# EAGLE design KL02LogicThingie (EAGLE 6.5.0)
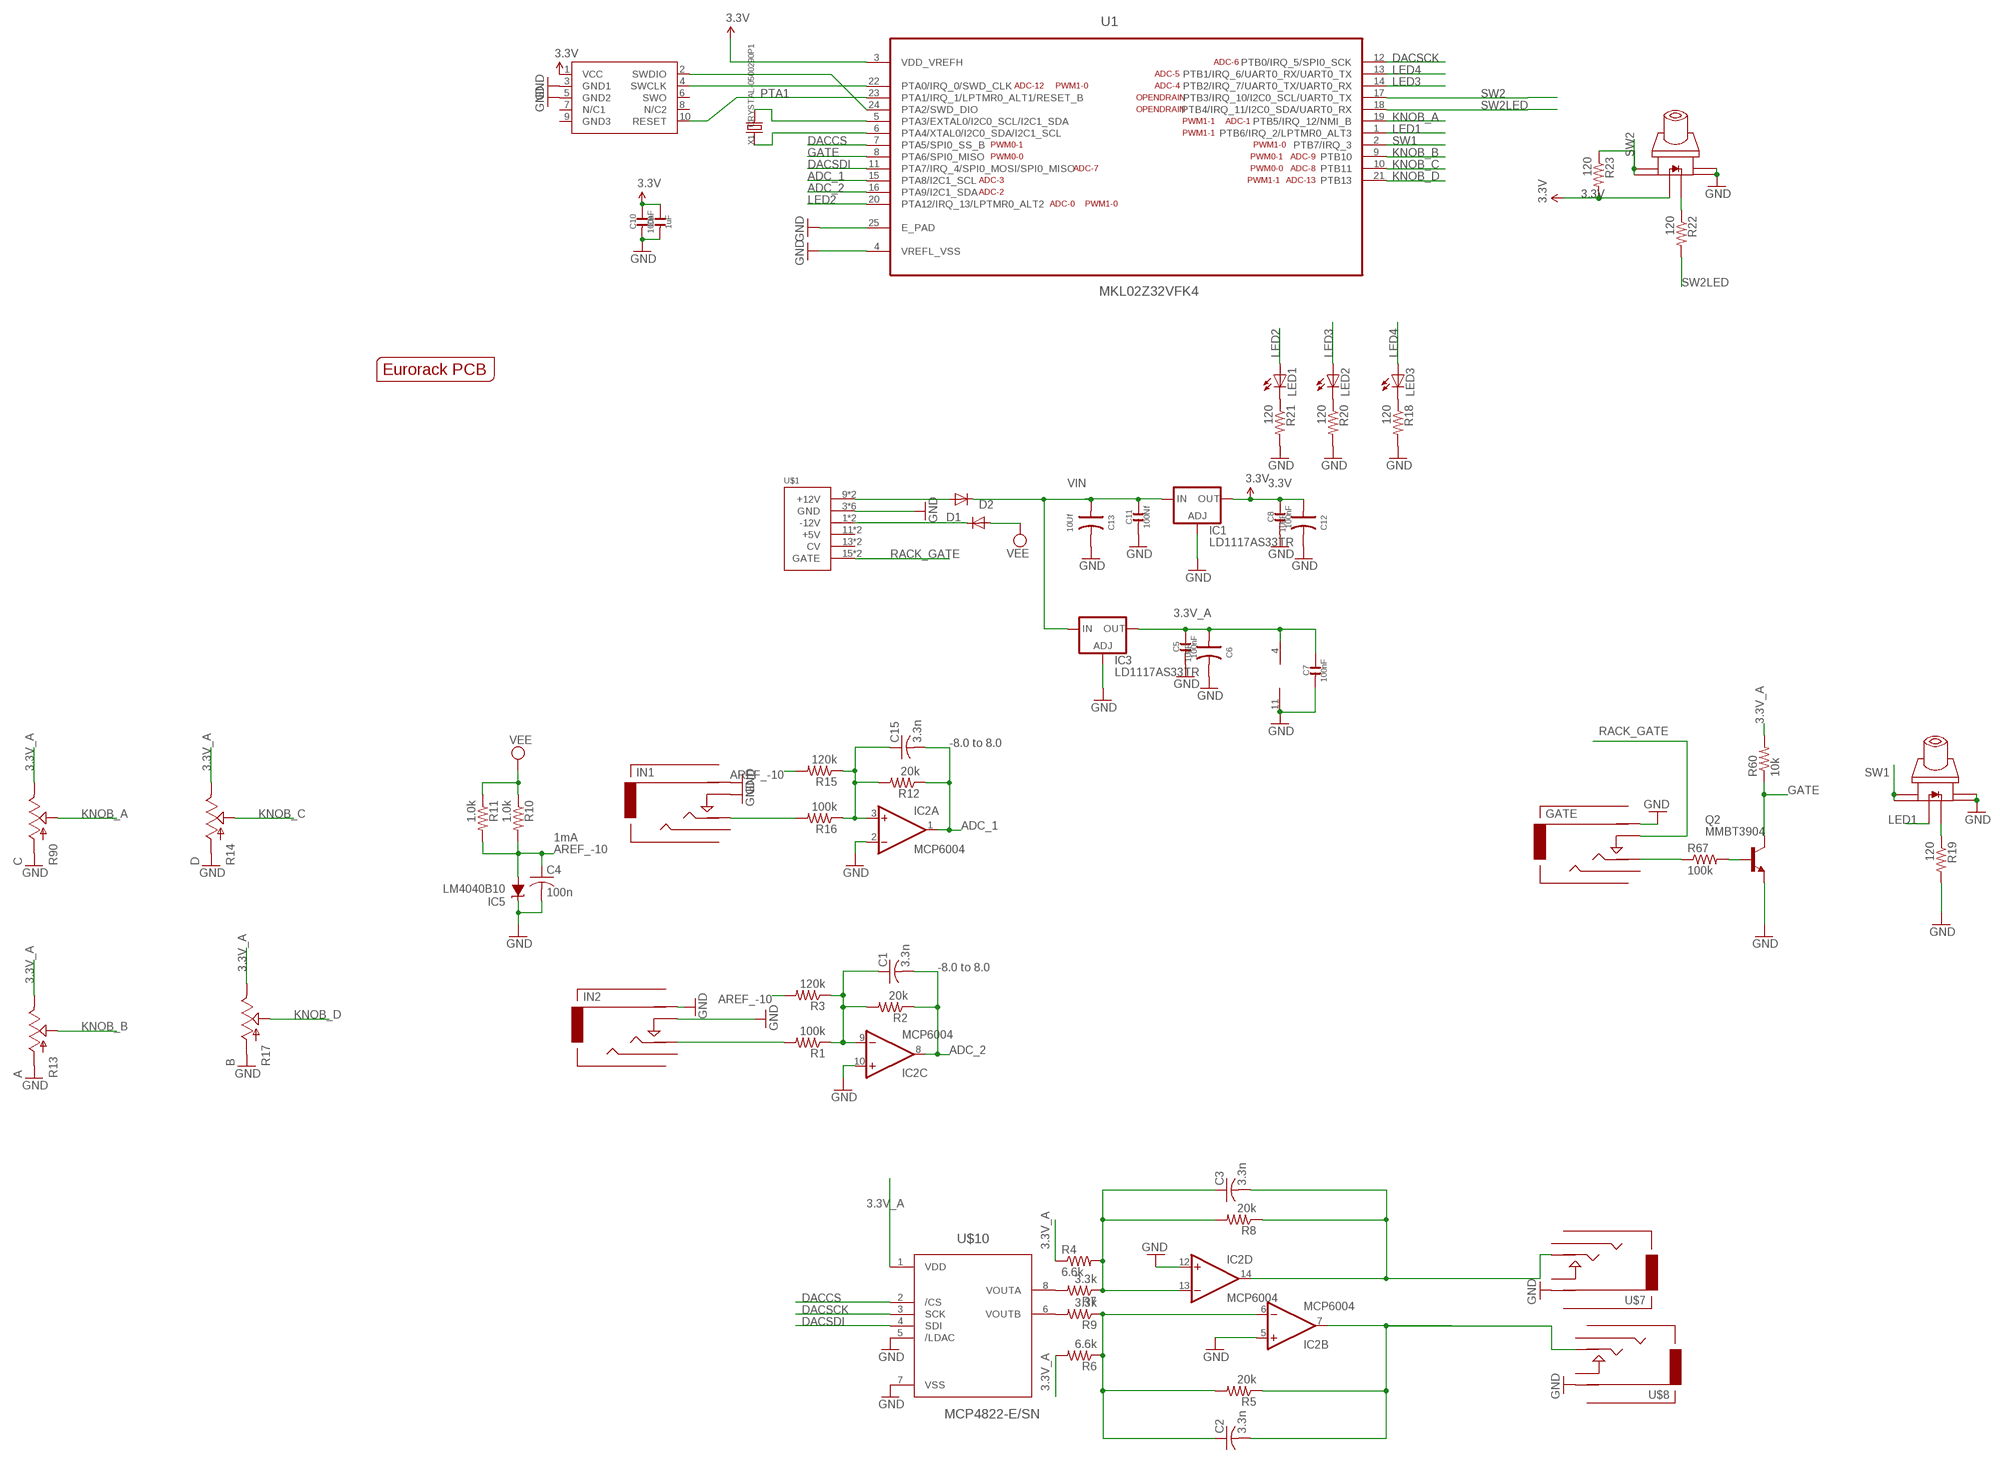
[diagram p0: schematic, sheet 1]

## Parts
C1  3.3n  C-USC0603  [C0603]
C2  3.3n  C-USC0603  [C0603]
C3  3.3n  C-USC0603  [C0603]
C4  100n  C-USC0603  [C0603]
C5  100nF  C-0603  [C0603]
C6  10uF  C-POLAR-A  [AVX-A]
C7  100nF  C-0603  [C0603]
C8  100nF  C-0603  [C0603]
C9  1uF  C-0603  [C0603]
C10  100nF  C-0603  [C0603]
C11  100Nf  C-0603  [C0603]
C12  10uF  C-POLAR-A  [AVX-A]
C13  10Uf  C-POLAR-A  [AVX-A]
C15  3.3n  C-USC0603  [C0603]
D1  1N5819HW  DIODE-SOD123  [SOD123]
D2  1N5819HW  DIODE-SOD123  [SOD123]
GATE  Gate  AUDIO-JACKINPUT  [3.5MM-JACK-SWITCH-13MM-INPUT]
IC1  LD1117AS33TR  [SOT223]
IC2  MCP6004  TL074D  [SO14]
IC3  LD1117AS33TR  [SOT223]
IC5  LM4040B10  LM4041B12DBZ  [DBZ_R-PDSO-G3]
IN1  In 2  AUDIO-JACKINPUT  [3.5MM-JACK-SWITCH-13MM-INPUT]
IN2  In 1  AUDIO-JACKINPUT  [3.5MM-JACK-SWITCH-13MM-INPUT]
LED1  LED3MM  [LED3MM]
LED2  LED3MM  [LED3MM]
LED3  LED3MM  [LED3MM]
Q2  MMBT3904  MMBT3904LT1-NPN-SOT23-BEC  [SOT23-BEC]
R1  100k  R-US_R0603  [R0603]
R2  20k  R-US_R0603  [R0603]
R3  120k  R-US_R0603  [R0603]
R4  6.6k  R-US_R0603  [R0603]
R5  20k  R-US_R0603  [R0603]
R6  6.6k  R-US_R0603  [R0603]
R7  3.3k  R-US_R0603  [R0603]
R8  20k  R-US_R0603  [R0603]
R9  3.3k  R-US_R0603  [R0603]
R10  1.0k  R-US_R0603  [R0603]
R11  1.0k  R-US_R0603  [R0603]
R12  20k  R-US_R0603  [R0603]
R13  A  POTZEPHPOT  [OG-POTS_ALPS_POT_VERTICAL]
R14  D  POTZEPHPOT  [OG-POTS_ALPS_POT_VERTICAL]
R15  120k  R-US_R0603  [R0603]
R16  100k  R-US_R0603  [R0603]
R17  B  POTZEPHPOT  [OG-POTS_ALPS_POT_VERTICAL]
R18  120  R-US_R0603  [R0603]
R19  120  R-US_R0603  [R0603]
R20  120  R-US_R0603  [R0603]
R21  120  R-US_R0603  [R0603]
R22  120  R-US_R0603  [R0603]
R23  120  R-US_R0603  [R0603]
R60  10k  R-US_R0603  [R0603]
R67  100k  R-US_R0603  [R0603]
R90  C  POTZEPHPOT  [OG-POTS_ALPS_POT_VERTICAL]
SWD1  CORTEX_SWD  [M50-3600542]
U1  MKL02Z32VFK4  [QFN50P400X400X100-25N]
U$1  POWER  [POWER_16]
U$2  EURORACK_PCB8HP  [EURORACK8HPPCB]
U$3  SWITCH_W_LED_PB6149L-X-102WHITE  [PB6149L]
U$6  SWITCH_W_LED_PB6149L-X-102WHITE  [PB6149L]
U$7  Out 2  AUDIO-JACKOUTPUT  [3.5MM-JACK-SWITCH-13MM-OUTPUT]
U$8  Out 1  AUDIO-JACKOUTPUT  [3.5MM-JACK-SWITCH-13MM-OUTPUT]
U$10  MCP4822-E/SN  [SOIC8-N_MC]
X1  CRYSTAL-0500290P1  [2P-SMD-5.0X3.2]

## Nets
3.3V: C8.2 C9.2 C10.2 C12.+ IC1.2(OUT) IC1.4(OUT) R23.2 SWD1.1(VCC) U1.3(VDD_VREFH) U$3.LEDPOS(POS)
3.3V_A: C5.2 C6.+ C7.2 IC2.4(P:V+) IC3.2(OUT) IC3.4(OUT) R4.1 R6.2 R13.P$1(E) R14.P$1(E) R17.P$1(E) R60.2 R90.P$1(E) U$10.1(VDD)
ADC_1: C15.2 IC2.1(A:OUT) R12.1 U1.15(PTA8/I2C1_SCL)
ADC_2: C1.2 IC2.8(C:OUT) R2.1 U1.16(PTA9/I2C1_SDA)
AREF_-10: C4.1 IC5.2(A) R3.2 R10.2 R11.2 R15.2
DACCS: U1.7(PTA5/SPI0_SS_B) U$10.2(/CS)
DACSCK: U1.12(PTB0/IRQ_5/SPI0_SCK) U$10.3(SCK)
DACSDI: U1.11(PTA7/IRQ_4/SPI0_MOSI/SPI0_MISO) U$10.4(SDI)
GATE: Q2.C R60.1 U1.8(PTA6/SPI0_MISO)
GND: C4.2 C5.1 C6.- C7.1 C8.1 C9.1 C10.1 C11.1 C12.- C13.- GATE.RING@1(RING) GATE.RING@2(RING) IC1.1(ADJ) IC2.2(A:-IN) IC2.5(B:+IN) IC2.10(C:+IN) IC2.11(P:V-) IC2.12(D:+IN) IC3.1(ADJ) IC5.1(C) IN1.RING@1(RING) IN1.RING@2(RING) IN1.SWITCH@1(SWITCH) IN1.SWITCH@2(SWITCH) IN2.RING@1(RING) IN2.RING@2(RING) IN2.SWITCH@1(SWITCH) IN2.SWITCH@2(SWITCH) Q2.E R13.P$3(A) R14.P$3(A) R17.P$3(A) R18.2 R19.2 R20.2 R21.2 R90.P$3(A) SWD1.3(GND1) SWD1.5(GND2) U1.4(VREFL_VSS) U1.25(E_PAD) U$1.3(GND) U$1.4(GND) U$1.5(GND) U$1.6(GND) U$1.7(GND) U$1.8(GND) U$3.3 U$3.4 U$6.3 U$6.4 U$7.RING@1(RING) U$7.RING@2(RING) U$8.RING@1(RING) U$8.RING@2(RING) U$10.5(/LDAC) U$10.7(VSS)
KNOB_A: R90.P$2(S) U1.19(PTB5/IRQ_12/NMI_B)
KNOB_B: R13.P$2(S) U1.9(PTB10)
KNOB_C: R14.P$2(S) U1.10(PTB11)
KNOB_D: R17.P$2(S) U1.21(PTB13)
LED1: U1.1(PTB6/IRQ_2/LPTMR0_ALT3) U$6.LEDPOS(POS)
LED2: LED1.A U1.20(PTA12/IRQ_13/LPTMR0_ALT2)
LED3: LED2.A U1.14(PTB2/IRQ_7/UART0_TX/UART0_RX)
LED4: LED3.A U1.13(PTB1/IRQ_6/UART0_RX/UART0_TX)
N$1: U1.5(PTA3/EXTAL0/I2C0_SCL/I2C1_SDA) X1.2
N$2: U1.6(PTA4/XTAL0/I2C0_SDA/I2C1_SCL) X1.1
N$3: IN1.TIP@1(TIP) IN1.TIP@2(TIP) R16.2
N$4: C15.1 IC2.3(A:+IN) R12.2 R15.1 R16.1
N$5: SWD1.4(SWCLK) U1.22(PTA0/IRQ_0/SWD_CLK)
N$6: IN2.TIP@1(TIP) IN2.TIP@2(TIP) R1.2
N$7: SWD1.2(SWDIO) U1.24(PTA2/SWD_DIO)
N$8: C1.1 IC2.9(C:-IN) R1.1 R2.2 R3.1
N$9: C2.1 IC2.6(B:-IN) R5.2 R6.1 R9.1
N$10: C3.1 IC2.13(D:-IN) R4.2 R7.1 R8.2
N$11: R7.2 U$10.8(VOUTA)
N$12: R9.2 U$10.6(VOUTB)
N$13: D1.A U$1.9(+12V) U$1.10(+12V)
N$14: R19.1 U$6.LEDNEG(NEG)
N$15: LED3.K(C) R18.1
N$16: LED2.K(C) R20.1
N$17: LED1.K(C) R21.1
N$18: C3.2 IC2.14(D:OUT) R8.1 U$7.TIP@1(TIP) U$7.TIP@2(TIP)
N$19: R22.1 U$3.LEDNEG(NEG)
N$24: C2.2 IC2.7(B:OUT) R5.1 U$8.TIP@1(TIP) U$8.TIP@2(TIP)
N$43: GATE.TIP@1(TIP) GATE.TIP@2(TIP) R67.1
N$64: D2.C U$1.1(-12V) U$1.2(-12V)
N$66: Q2.B R67.2
PTA1: SWD1.10(RESET) U1.23(PTA1/IRQ_1/LPTMR0_ALT1/RESET_B)
RACK_GATE: GATE.SWITCH@1(SWITCH) GATE.SWITCH@2(SWITCH) U$1.15(GATE) U$1.16(GATE)
SW1: U1.2(PTB7/IRQ_3) U$6.1 U$6.2
SW2: R23.1 U1.17(PTB3/IRQ_10/I2C0_SCL/UART0_TX) U$3.1 U$3.2
SW2LED: R22.2 U1.18(PTB4/IRQ_11/I2C0_SDA/UART0_RX)
VEE: D2.A R10.1 R11.1
VIN: C11.2 C13.+ D1.C IC1.3(IN) IC3.3(IN)
Unconnected: GATE.SECOND@1(SECOND) GATE.SECOND@2(SECOND) IN1.SECOND@1(SECOND) IN1.SECOND@2(SECOND) IN2.SECOND@1(SECOND) IN2.SECOND@2(SECOND) SWD1.6(SWO) SWD1.7(N/C1) SWD1.8(N/C2) SWD1.9(GND3) U$1.11(+5V) U$1.12(+5V) U$1.13(CV) U$1.14(CV) U$7.SECOND@1(SECOND) U$7.SECOND@2(SECOND) U$7.SWITCH@1(SWITCH) U$7.SWITCH@2(SWITCH) U$8.SECOND@1(SECOND) U$8.SECOND@2(SECOND) U$8.SWITCH@1(SWITCH) U$8.SWITCH@2(SWITCH)

## Notes on the sheet
- -8.0 to 8.0
- 1mA
- -8.0 to 8.0

## Library data of the parts
C1-C4 C15 = rcl:C-US: CAPACITOR, American symbol
C5 C7-C11 = OPL:C*
C6 C12 C13 = OPL:C-POLAR*
D1 D2 = diode:DIODE-: DIODE
GATE IN1 IN2 U$7 U$8 = EurorackModularParts:AUDIO-JACK: Switching Mono 3.5mm Audio Jack from Erthenvar.
IC1 IC3 = ld-components:LD1117A?*: Low drop fixed and adjustable positive voltage regulators 1 A Source: http://www.st.com/stonline/products/literature/ds/7194/ld1117axx.pdf
IC2 = gm-ics:TL074: OP AMP
IC5 = texas:LM4041: PRECISION MICROPOWER SHUNT VOLTAGE REFERENCE Source: http://focus.ti.com/lit/ds/slcs146e/slcs146e.pdf; MPN: LM4041B12IDBZR; OC_FARNELL: 1575212; OC_NEWARK: 58K5882
LED1-LED3 = SparkFun-LED:LED: LEDs Standard schematic elements and footprints for 5mm, 3mm, 1206, and 0603 sized LEDs. 5mm - Spark Fun Electronics SKU : COM-00529 (and others)
Q2 = transistor:*-NPN-: NPN Transistror BF959 corrected 2008.03.06
R1-R12 R15 R16 R18-R23 R60 R67 = rcl:R-US_: RESISTOR, American symbol
R13 R14 R17 R90 = EurorackModularParts:POT
SWD1 = carrilib with jtags:CORTEX_SWD: .05" Cortex M Connector in SWD mode Manufacturer: Generic Part Number: Cortex M SWD Notes: I use Harwin M50-3600542 connectors
U1 = FarnellThings:MKL02Z32VFK4: IC, MCU, 32BIT, CORTEX M0+, 48MHZ, QFN-24; MPN: MKL02Z32VFK4; OC_FARNELL: 2321481; OC_NEWARK: 61W9887; PACKAGE: QFN-24; SUPPLIER: FREESCALE SEMICONDUCTOR
U$1 = eurorack:POWER
U$2 = EurorackModularParts:EURORACK_PCB
U$3 U$6 = zephod-components:SWITCH_W_LED_PB6149L-X-102
U$10 = FarnellThings:MCP4822-E/SN: 12 Bit DAC; DESCRIPTION: 12 Bit DAC; MPN: MCP4822-E/SN; OC_FARNELL: 1439414; OC_NEWARK: 31K2975; PACKAGE: SOIC-8; SUPPLIER: Microchip
X1 = OPL:CRYSTAL*

## Board
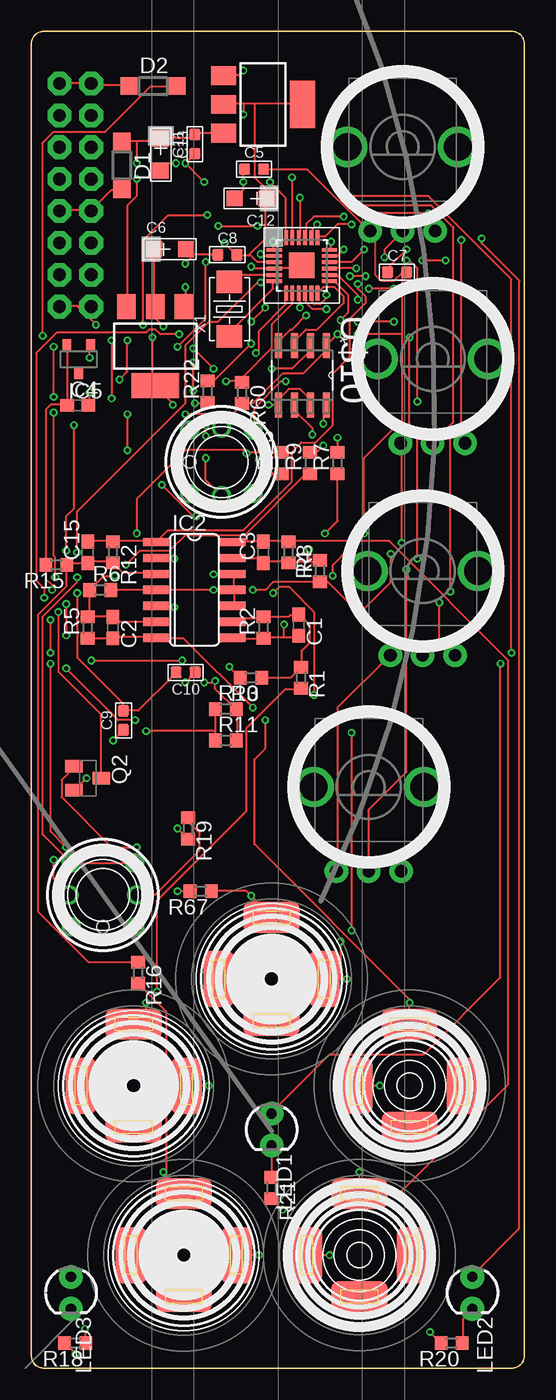
[diagram p1: board, top side]
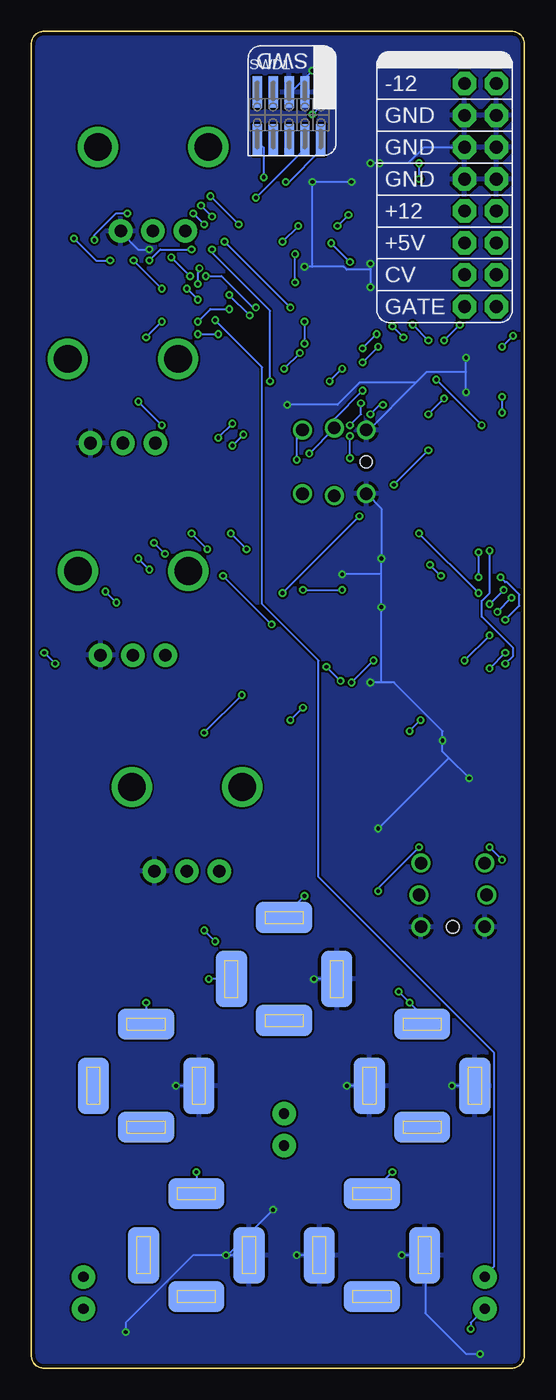
[diagram p2: board, bottom side, seen from below]

Size 39.3 x 106.5 mm. Coordinates in mm from the lower left corner, seen from the top.
Copper layers (1*16): Top 0.035mm / dielectric 1.5mm / Bottom 0.035mm
Design rules "ITEADstudio_DRC": minimum track width 6mil, minimum drill 12mil, track to track 6mil, track to pad 6mil, pad to pad 6mil, via to via 6mil, smd to smd 0mil, copper to edge 10mil, drill to drill 10mil, minimum pad ring 10mil, minimum via ring 6mil, stop-mask expansion 2mil, vias tented up to drill 100mil, thermal gap 10mil

### Footprints (pad centres in the part's own frame; a part is rotated, then mirrored left to right if it is on the bottom)
C0603 = smd 1.1 x 1: 1 -0.85,0; 2 0.85,0
C0603' = smd 0.889 x 0.889: 1 -0.762,0; 2 0.762,0
AVX-A = smd 1.27 x 1.27: + -1.27,0; - 1.27,0
SOD123 = smd 1.4 x 1.4: A 1.9,0; C -1.9,0
3.5MM-JACK-SWITCH-13MM-INPUT = smd 2.5 x 4.5: RING@1 -4.2,0; SWITCH@1 4.2,0 | smd 2.5 x 4.5 bottom: RING@2 -4.2,0; SWITCH@2 4.2,0 | smd 4.5 x 2.5: SECOND@1 0,-3.3; TIP@1 0,4.9 | smd 4.5 x 2.5 bottom: SECOND@2 0,-3.3; TIP@2 0,4.9
SOT223 = smd 1.5 x 2: 1 -2.3,-3.15; 2 0,-3.15; 3 2.3,-3.15 | smd 3.8 x 2: 4 0,3.15
SO14 = smd 0.66 x 2.032: 1 -3.81,-3.073; 2 -2.54,-3.073; 3 -1.27,-3.073; 4 0,-3.073; 5 1.27,-3.073; 6 2.54,-3.073; 7 3.81,-3.073; 8 3.81,3.073; 9 2.54,3.073; 10 1.27,3.073; 11 0,3.073; 12 -1.27,3.073; 13 -2.54,3.073; 14 -3.81,3.073
DBZ_R-PDSO-G3 = smd 0.7 x 1: 1 -0.95,-1.1; 2 0.95,-1.1; 3 0,1.1
LED3MM = drill 0.813 pad 1.88: A -1.27,0; K 1.27,0
SOT23-BEC = smd 1 x 1.4: B -0.95,-1.1; C 0,1.1; E 0.95,-1.1
R0603 = smd 1 x 1.1: 1 -0.85,0; 2 0.85,0
OG-POTS_ALPS_POT_VERTICAL = drill 1 pad 1.88: P$1 -2.58,-6.7; P$2 0,-6.7; P$3 2.58,-6.7 | drill 2.2 pad 3.175: P$4 4.4,0; P$5 -4.4,0
M50-3600542 = smd 0.75 x 2.5: 1 -2.54,-1.81; 2 -2.54,2; 3 -1.27,-1.81; 4 -1.27,2; 5 0,-1.81; 6 0,2; 7 1.27,-1.81; 8 1.27,2; 9 2.54,-1.81; 10 2.54,2
QFN50P400X400X100-25N = smd 1.2 x 0.3: 1 -2.2,1.245; 2 -2.2,0.762; 3 -2.2,0.254; 4 -2.2,-0.254; 5 -2.2,-0.762; 6 -2.2,-1.245; 13 2.2,-1.245; 14 2.2,-0.762; 15 2.2,-0.254; 16 2.2,0.254; 17 2.2,0.762; 18 2.2,1.245 | smd 0.3 x 1.2: 7 -1.245,-2.2; 8 -0.762,-2.2; 9 -0.254,-2.2; 10 0.254,-2.2; 11 0.762,-2.2; 12 1.245,-2.2; 19 1.245,2.2; 20 0.762,2.2; 21 0.254,2.2; 22 -0.254,2.2 | smd 0.305 x 1.2: 23 -0.762,2.2; 24 -1.245,2.2 | smd 2.032 x 2.032: 25 0,0
POWER_16 = drill 1.016 pad 1.88 octagon: 1 -6.35,-1.27; 2 -6.35,1.27; 3 -3.81,-1.27; 4 -3.81,1.27; 5 -1.27,-1.27; 6 -1.27,1.27; 7 1.27,-1.27; 8 1.27,1.27; 9 3.81,-1.27; 10 3.81,1.27; 11 6.35,-1.27; 12 6.35,1.27; 13 8.89,-1.27; 14 8.89,1.27; 15 11.43,-1.27; 16 11.43,1.27
PB6149L = drill 1: 1 2.54,2.54; 2 2.54,-2.54; 3 -2.54,2.54; 4 -2.54,-2.54; LEDNEG 0,-2.7; LEDPOS 0,2.7 | hole 1: -2.54,0
3.5MM-JACK-SWITCH-13MM-OUTPUT = smd 2.5 x 4.5: RING@1 -4.2,0; SWITCH@1 4.2,0 | smd 2.5 x 4.5 bottom: RING@2 -4.2,0; SWITCH@2 4.2,0 | smd 4.5 x 2.5: SECOND@1 0,-3.3; TIP@1 0,4.9 | smd 4.5 x 2.5 bottom: SECOND@2 0,-3.3; TIP@2 0,4.9
SOIC8-N_MC = smd 1.981 x 0.559: 1 -2.362,1.905; 2 -2.362,0.635; 3 -2.362,-0.635; 4 -2.362,-1.905; 5 2.362,-1.905; 6 2.362,-0.635; 7 2.362,0.635; 8 2.362,1.905
2P-SMD-5.0X3.2 = smd 1.778 x 2.032: 1 -2.159,0; 2 2.159,0

### Placement (x,y rotation side)
C1  21.3,59.2 270 top
C2  6.5,59 270 top
C3  18.5,65 90 top
C4  3.7,76.7 0 top
C5  100nF  [C0603']  17.74,95.52 0 top
C6  11.05,89.14 0 top
C7  100nF  [C0603']  29.15,87.31 0 top
C8  100nF  [C0603']  15.62,88.7 0 top
C9  1uF  [C0603']  7.34,51.61 90 top
C10  100nF  [C0603']  12.3,55.43 180 top
C11  100Nf  [C0603']  13.03,97.52 90 top
C12  17.47,93.19 180 top
C13  10.32,96.68 270 top
C15  4.5,65 90 top
D1  7.21,95.83 270 top
D2  9.71,102.14 0 top
GATE  19.15,31 0 top
IC1  18.47,100.68 270 top
IC2  13,62 270 top
IC3  9.88,81.42 180 top
IC5  3.78,80.38 180 top
IN1  12.15,9 0 top
IN2  8.15,22.5 0 top
LED1  19.15,19 270 top
LED2  35.15,6 270 top
LED3  3.15,6 270 top
Q2  4.5,47 270 top
R1  21.5,55 270 top
R2  18.5,59 90 top
R3  17.5,55 180 top
R4  23,63.5 90 top
R5  4.5,59 90 top
R6  5.5,62 0 top
R7  24.4,72.1 90 top
R8  20.5,65 270 top
R9  22.2,72.1 90 top
R10  15.5,52.5 0 top
R11  15.5,50 0 top
R12  6.5,65 270 top
R13  29.6,97.3 0 top
R14  26.9,46.3 0 top
R15  2,64 180 top
R16  8.5,31.5 270 top
R17  32,80.4 0 top
R18  3.5,2 180 top
R19  12.5,43 270 top
R20  33.5,2 180 top
R21  19.15,14.35 270 top
R22  14.05,77.8 90 top
R23  19.95,72.1 90 top
R60  16.8,77.7 270 top
R67  13.5,38 180 top
R90  31.2,63.5 0 top
SWD1  18.76,99.85 180 bottom
U1  21.56,87.85 0 top
U$1  3.5,96 270 bottom
U$2  -0.5,0 0 top
U$3  15.15,72.2 0 top
U$6  5.7,37.7 90 top
U$7  26.15,9 0 top
U$8  30.15,22.5 0 top
U$10  21.6,79.1 270 top
X1  15.79,84.37 90 top

### Tracks (layer width: path | path; a pad name or v marks a point on that pad's centre or on a via)
3.3V  (via drill 0.3)
  Top 0.152: 17.27,88.62 17.52,88.62 18.02,88.12 19.27,88.12 U1.3 | 17.27,88.62 16.4,88.62 C8.2 16.27,88.75 v15.4,89.62 | 17.27,88.62 18.65,90 18.65,93.12 C12.+ 18.65,93.25 18.65,94 17.77,94.88 17.77,100.75 | 17.77,100.75 21.52,100.75 IC1.4 | 17.77,100.75 16.9,100.75 | 16.9,100.75 15.4,100.75 IC1.2 | 16.9,100.75 v16.9,99.88 | C10.2 11.52,55.38 8.52,52.38 7.4,52.38 C9.2 7.27,52.38 7.27,53 3.65,56.62 v3.65,61.75 | R23.2 19.9,73 17.27,73 v17.15,72.88 16.9,73.12 12.27,73.12 8.4,69.25 v8.4,66.5 | v13.9,88.12 13.9,83.62 v11.65,81.38 | v12.9,77.88 v12.9,80.12
  Bottom 0.152: v16.9,99.88 16.27,100.5 16.27,101.62 SWD1.1 | v17.15,72.88 15.15,74.88 U$3.LEDPOS 15.15,75.62 v12.9,77.88 | v8.4,66.5 v3.65,61.75 | v13.9,88.12 v15.4,89.62 | v12.9,80.12 v11.65,81.38
3.3V_A  (via drill 0.3)
  Top 0.152: C6.+ 9.77,89.12 9.77,84.62 IC3.2 9.9,84.5 9.9,83.62 v10.52,83 | v9.65,82.12 9.65,78.5 IC3.4 11.27,76.88 v11.27,76.75 | C5.2 18.52,95.5 22.02,95.5 26.9,90.62 R13.P$1 27.02,90.5 27.4,90.12 27.4,87.12 27.9,86.62 28.9,86.62 29.52,87.25 | 29.52,87.25 29.9,87.25 C7.2 29.52,87.25 | 29.52,87.25 29.52,82.38 | 29.52,82.38 29.52,73.75 R17.P$1 29.52,73.62 v29.52,65.75 | v24.4,82.38 23.52,81.5 U$10.1 23.4,81.38 23.4,81 21.65,79.25 20.02,79.25 17.65,76.88 16.9,76.88 R60.2 16.77,76.75 16.02,76 v12.27,76 | 29.52,82.38 v26.02,82.38 | R6.2 IC2.4 v14.52,62 | 26.15,60.12 28.52,57.75 28.52,56.88 R90.P$1 28.52,56.75 24.4,52.62 24.4,39.62 R14.P$1 | 26.15,60.12 23.65,62.62 23.02,62.62 R4.1 22.9,62.62 19.27,62.62 18.65,62 v17.65,62 | v28.65,64.88 28.65,62.62 26.15,60.12
  Bottom 0.152: v9.65,82.12 v10.52,83 | v26.02,82.38 v24.4,82.38 | v11.27,76.75 11.52,76.75 v12.27,76 | v17.65,62 v14.52,62 | v28.65,64.88 v29.52,65.75
ADC_1  (via drill 0.3)
  Top 0.152: C15.2 4.52,65.88 6.4,65.88 R12.1 6.52,65.88 9.9,65.88 IC2.1 10.02,65.88 10.9,66.75 16.9,66.75 20.77,70.62 20.77,73 21.52,73.75 22.65,73.75 24.02,75.12 24.02,79.25 25.4,80.62 25.4,83.62 26.65,84.88 26.65,85.38 26.02,86 v26.02,86.38 | v25.9,87.62 23.77,87.62 U1.15
  Bottom 0.152: v25.9,87.62 25.9,87.38 26.02,87.25 v26.02,86.38
ADC_2  (via drill 0.3)
  Top 0.152: IC2.8 16.15,58.12 18.4,58.12 R2.1 18.52,58.25 20.15,58.25 | 20.15,58.25 21.27,58.25 C1.2 | v26.52,89.12 25.52,88.12 23.77,88.12 U1.16 | v29.9,88.25 30.15,88.25 30.77,87.62 v30.77,77 | v28.9,75.12 28.9,74.88 26.52,72.5 v26.52,66.5 | v25.27,65.25 24.02,64 v24.02,63.12 | 20.15,58.25 v20.15,59.25
  Bottom 0.152: v26.52,89.12 29.02,89.12 v29.9,88.25 | v28.9,75.12 v30.77,77 | v25.27,65.25 v26.52,66.5 | v20.15,59.25 v24.02,63.12
AREF_-10  (via drill 0.3)
  Top 0.152: R11.2 16.4,50 16.4,52.5 R10.2 16.27,52.5 14.65,54.12 14.65,54.62 | v15.77,55.88 R3.2 | IC5.2 2.9,81.38 2.9,76.75 C4.1 2.77,76.75 1.52,76.75 1.15,76.38 R15.2 1.15,62.88 1.65,62.38 v1.65,62 | v13.77,54.62 14.65,54.62 | v4.77,56.38 v12.02,56.38 | v2.77,60.88 v2.77,58.38 | 14.65,54.62 v14.65,54.75
  Bottom 0.152: v14.65,54.75 v15.77,55.88 | v12.02,56.38 v13.77,54.62 | v2.77,58.38 v4.77,56.38 | v1.65,62 v2.77,60.88
DACCS  (via drill 0.3)
  Top 0.152: v17.9,80.88 18.15,81.12 18.15,82.62 20.27,84.75 20.27,85.62 U1.7 | v19.15,79.62 20.77,79.62 22.15,81 22.15,81.38 U$10.2
  Bottom 0.152: v19.15,79.62 v17.9,80.88
DACSCK
  Top 0.152: U1.12 22.9,85.75 23.27,86.12 24.15,86.12 24.9,85.38 24.9,84.88 22.77,82.75 21.9,82.75 21.02,81.88 21.02,81.5 U$10.3
DACSDI  (via drill 0.3)
  Top 0.152: v23.52,85.5 23.52,85.25 23.02,84.75 22.52,84.75 22.4,84.88 22.4,85.62 U1.11 | v21.9,83.88 20.77,82.75 20.65,82.75 19.77,81.88 19.77,81.5 U$10.4
  Bottom 0.152: v21.9,83.88 v23.52,85.5
GATE  (via drill 0.3)
  Top 0.152: U1.8 20.77,85.62 20.77,84.75 19.15,83.12 19.15,81.25 16.9,79 16.9,78.62 R60.1 16.77,78.62 v15.52,78.62 | v2.15,60.25 2.15,55.5 5.52,52.12 5.52,47 Q2.C | v1.02,61.38 1.02,62.12 0.4,62.75 0.4,80.88 2.02,82.5 9.15,82.5 9.4,82.75 9.9,82.75 10.27,82.38 v11.77,82.38 | v14.52,79.62 v12.9,81.25
  Bottom 0.152: v1.02,61.38 v2.15,60.25 | v12.9,81.25 v11.77,82.38 | v15.52,78.62 v14.52,79.62
GND  (via drill 0.3)
  Top 0.152: 16.15,62 16.15,60.75 IC2.10 | 16.15,62 16.15,63.25 IC2.12 16.02,63.25 v14.52,63.25 | 16.15,62 IC2.11 | v6.52,50 7.27,50.75 C9.1 | v4.4,47 3.4,46 Q2.E | v12.27,54.62 13.02,55.38 C10.1 | v11.65,43 R19.2 | v11.4,60.62 10.02,60.62 IC2.5 | v11.4,64.5 10.02,64.5 IC2.2 | C5.1 16.9,95.5 v16.9,94.5 16.9,93.88 16.27,93.25 C12.- | v11.52,96 10.9,96 10.4,95.5 C13.- | C11.1 v12.27,96 v13.77,94.5 | U1.25 21.52,87.75 21.4,87.62 19.4,87.62 U1.4 19.27,87.62 17.65,87.62 v17.52,87.75 | 13.02,88.75 12.77,88.75 12.4,89.12 C6.- | 13.02,88.75 14.77,88.75 C8.1 | v12.27,86.12 12.27,84.62 IC3.1 | 13.02,88.75 v12.27,88 | U$10.7 22.15,76.75 22.15,77.25 21.4,78 20.52,78 19.77,77.25 19.77,76.75 U$10.5 19.65,76.75 v18.9,76.75 | v4.65,80.5 4.65,81.38 IC5.1 | v4.65,77.75 4.65,76.75 C4.2 | v29.9,89.12 28.4,87.62 28.4,87.38 C7.1 | v3.52,1.12 R18.2 | v31.77,2.88 R20.2 | v20.02,12.62 R21.2 | v16.9,103.38 16.52,103 15.4,103 IC1.1 | v5.77,22.5 IN2.RING@2 | v9.77,9 IN1.RING@2 | v14.15,22.5 IN2.SWITCH@2 | v18.15,9 IN1.SWITCH@2 | v23.77,9 U$7.RING@2 | v27.77,22.5 U$8.RING@2 | v16.77,31 GATE.RING@2
  Bottom 0.152: v4.4,47 6.02,48.62 | 6.02,48.62 6.52,49.12 v6.52,50 6.52,50.75 10.4,54.62 11.4,54.62 | 11.4,54.62 v12.27,54.62 | 6.02,48.62 v11.65,43 | 11.4,54.62 v11.4,60.62 11.4,63.25 | 11.4,63.25 v11.4,64.5 11.4,68.5 12.52,69.62 U$3.4 | 11.4,63.25 v14.52,63.25 | v12.27,96 v11.52,96 9.27,96 8.02,97.25 4.77,97.25 U$1.5 | v13.77,94.5 v16.9,94.5 16.9,87.75 | v12.27,88 12.27,87.5 | 12.27,87.5 v12.27,86.12 | 16.9,87.75 14.4,87.75 14.15,87.5 12.27,87.5 | 16.9,87.75 v17.52,87.75 | v4.65,77.75 4.65,79.38 | 4.65,79.38 v4.65,80.5 | v29.9,89.12 30.77,89.12 32.15,90.5 R13.P$3 | v3.52,1.12 4.65,1.12 7.9,4.38 7.9,9 IN1.RING@2 v9.77,9 | v31.77,2.88 31.77,3.62 26.4,9 v23.77,9 23.65,9 | U$7.RING@2 23.65,9 | 23.65,9 v20.02,12.62 | v16.9,103.38 18.65,101.62 SWD1.5 | 4.65,79.38 7.77,79.38 8.65,78.5 | 8.65,78.5 12.52,74.62 U$3.3 | v18.9,76.75 14.9,76.75 13.15,78.5 8.65,78.5 | IN2.RING@2 v5.77,22.5 | IN2.SWITCH@2 v14.15,22.5 | IN1.SWITCH@2 v18.15,9 | U$8.RING@2 v27.77,22.5 | GATE.RING@2 v16.77,31
  pour Bottom: -1.95,104.7 -1.25,-2 41.65,-2 41.65,107 -1.35,107
KNOB_A  (via drill 0.3)
  Top 0.152: v25.52,91.12 24.4,91.12 23.4,90.12 22.9,90.12 U1.19 | v31.65,92 v26.4,92 | v34.27,89.88 34.27,75.12 33.4,74.25 v33.4,61.88 | v32.52,61 32.52,58.12 R90.P$2
  Bottom 0.152: v26.4,92 v25.52,91.12 | v31.65,92 32.52,92 34.27,90.25 v34.27,89.88 | v32.52,61 v33.4,61.88
KNOB_B  (via drill 0.3)
  Top 0.152: v21.4,84.5 21.4,85.62 U1.9 | v26.65,87 v25.4,87 | v28.15,88.5 28.15,89.12 29.52,90.5 R13.P$2
  Bottom 0.152: v21.4,84.5 21.65,84.5 24.15,87 v25.4,87 | v28.15,88.5 v26.65,87
KNOB_C  (via drill 0.3)
  Top 0.152: v23.52,84.38 22.4,84.38 21.9,84.88 21.9,85.62 U1.10 | v28.9,83.38 v26.02,83.38 | v30.15,82.12 30.15,74.62 30.77,74 v30.77,64.5 | v29.9,63.62 29.9,47.5 26.9,44.5 R14.P$2
  Bottom 0.152: v23.52,84.38 25.02,84.38 v26.02,83.38 | v30.15,82.12 v28.9,83.38 | v29.9,63.62 v30.77,64.5
KNOB_D  (via drill 0.3)
  Top 0.152: v24.9,91.75 22.52,91.75 21.9,91.12 21.9,90.12 U1.21 | v25.77,92.62 31.9,92.62 33.65,90.88 33.65,75.38 32.02,73.75 R17.P$2
  Bottom 0.152: v25.77,92.62 v24.9,91.75
LED1  (via drill 0.3)
  Top 0.152: v19.27,89.75 19.27,89.12 U1.1 | v14.9,91 v18.02,91 | v14.02,91.88 10.9,91.88 8.9,89.88 v8.9,83.12 | v7.65,81.88 7.65,79.38 v7.02,78.75 | v3.4,75.12 3.4,68.5 2.77,67.88 v2.77,65.12 | v1.52,56.12 1.52,42.75 v2.77,41.5 | v1.77,40.5 1.77,39 3.02,37.75 U$6.LEDPOS
  Bottom 0.152: v18.02,91 v19.27,89.75 | v14.02,91.88 v14.9,91 | v7.65,81.88 v8.9,83.12 | v3.4,75.12 v7.02,78.75 | v2.77,65.12 2.77,61.75 3.4,61.12 3.4,59.88 0.9,57.38 0.9,56.75 v1.52,56.12 | v1.77,40.5 v2.77,41.5
LED2  (via drill 0.3)
  Top 0.152: v22.77,91.12 22.4,90.75 22.4,90.12 U1.20 | v25.02,93.38 31.65,93.38 38.27,86.75 v38.27,57 | v37.4,56.12 37.4,31.12 31.27,25 23.77,25 19.15,20.38 LED1.A
  Bottom 0.152: v25.02,93.38 v22.77,91.12 | v37.4,56.12 v38.27,57
LED3  (via drill 0.3)
  Top 0.152: v26.02,85.12 26.02,85.5 24.52,87 23.77,87 U1.14 | v28.9,86 v26.9,86 | v33.02,88.25 v31.15,88.25 | v35.9,90 35.9,89.62 38.9,86.62 38.9,11.12 35.15,7.38 LED2.A
  Bottom 0.152: v26.9,86 v26.02,85.12 | v31.15,88.25 v28.9,86 | v33.02,88.25 34.15,88.25 v35.9,90
LED4  (via drill 0.3)
  Top 0.152: v24.65,83.5 25.27,84.12 25.27,85.5 24.27,86.5 23.77,86.5 U1.13
  Bottom 0.152: v24.65,83.5 20.9,79.75 20.9,60.88 16.4,56.38 16.4,39.12 2.4,25.12 2.4,8.12 3.15,7.38 LED3.A
N$1
  Top 0.152: U1.5 19.27,87.12 16.4,87.12 15.9,86.62 X1.2
N$2
  Top 0.152: U1.6 19.27,86.5 19.27,86 15.9,82.62 15.9,82.25 X1.1
N$3  (via drill 0.3)
  Top 0.152: R16.2 10.77,28.38 10.77,15.62 | 10.77,15.62 10.77,15.38 12.15,14 IN1.TIP@2 | 10.77,15.62 v10.52,15.62
  Bottom 0.152: v10.52,15.62 12.15,14 IN1.TIP@2
N$4
  Top 0.152: R16.1 8.4,32.38 4.52,32.38 0.52,36.38 0.52,60 2.77,62.25 2.77,64 R15.1 2.9,64 3.02,64.12 4.4,64.12 C15.1 4.52,64.25 6.4,64.25 R12.2 7.27,63.38 9.9,63.38 IC2.3
N$5  (via drill 0.3)
  Top 0.152: v21.4,93.25 21.4,90.12 U1.22
  Bottom 0.152: v21.4,93.25 17.52,97.12 17.52,97.75 SWD1.4
N$6  (via drill 0.3)
  Top 0.152: v10.02,30 10.02,37.25 17.15,44.38 17.15,51 20.27,54.12 21.4,54.12 R1.2 | v9.15,29.12 9.15,28.5 8.15,27.5 IN2.TIP@2
  Bottom 0.152: v10.02,30 v9.15,29.12 8.15,28.12 IN2.TIP@2
N$7  (via drill 0.3)
  Top 0.152: v19.02,94.5 20.27,93.25 20.27,90.12 U1.24
  Bottom 0.152: v19.02,94.5 18.77,94.5 16.27,97 16.27,97.75 SWD1.2
N$8
  Top 0.152: R3.1 20.65,55 R1.1 21.52,55.88 21.52,57.12 22.15,57.75 22.15,59.25 21.4,60 C1.1 21.27,60 20.65,60 20.52,59.88 18.52,59.88 R2.2 18.4,59.75 16.4,59.75 16.15,59.5 IC2.9
N$9  (via drill 0.3)
  Top 0.152: 4.65,59.88 6.4,59.88 C2.1 6.52,59.75 6.77,59.5 9.9,59.5 IC2.6 | 4.65,59.88 4.52,59.88 R5.2 4.65,59.88 | 4.65,59.88 R6.1 5.77,63.12 v6.65,63.12 | R9.1 21.9,71.25 17.02,66.38 12.27,66.38 11.02,65.12 8.65,65.12 v7.52,64
  Bottom 0.152: v6.65,63.12 v7.52,64
N$10  (via drill 0.3)
  Top 0.152: 22.15,64.25 20.52,64.25 R8.2 20.4,64.25 18.52,64.25 C3.1 18.15,64.5 16.15,64.5 IC2.13 | 22.15,64.25 22.9,64.25 R4.2 | R7.1 24.4,67.5 v23.4,66.5 | 22.15,64.25 v22.15,65.25
  Bottom 0.152: v22.15,65.25 v23.4,66.5
N$11  (via drill 0.3)
  Top 0.152: v24.4,74.12 R7.2 | v23.27,75.25 23.27,76.5 23.4,76.62 U$10.8
  Bottom 0.152: v23.27,75.25 v24.4,74.12
N$12  (via drill 0.3)
  Top 0.152: v23.27,73.5 22.77,73 22.27,73 R9.2 | v22.4,74.38 22.4,74.88 21.02,76.25 21.02,76.62 U$10.6
  Bottom 0.152: v22.4,74.38 v23.27,73.5
N$13
  Top 0.152: D1.A 7.15,93.88 6.4,93.88 4.77,92.25 U$1.9 4.65,92.25 2.27,92.25 U$1.10
N$14
  Top 0.152: R19.1 12.52,43.75 12.52,43.5 13.4,42.62 13.4,41.25 9.9,37.75 8.4,37.75 U$6.LEDNEG
N$15  (via drill 0.3)
  Top 0.152: v4.27,3.12 4.27,2 R18.1
  Bottom 0.152: v4.27,3.12 4.27,3.62 3.15,4.75 LED3.K
N$16
  Top 0.152: R20.1 34.4,2 34.4,3.88 35.15,4.62 LED2.K
N$17
  Top 0.152: LED1.K R21.1
N$18  (via drill 0.3)
  Top 0.152: IC2.14 16.15,65.88 18.4,65.88 C3.2 18.52,65.88 20.4,65.88 R8.1 20.52,65.88 28.52,65.88 38.02,56.38 38.02,22.62 29.4,14 26.15,14 | 26.15,14 v26.15,15.62 | 26.15,14 U$7.TIP@2
  Bottom 0.152: v26.15,15.62 U$7.TIP@2
N$19  (via drill 0.3)
  Top 0.152: v13.02,76.88 14.02,76.88 R22.1 | v13.9,74.25 v13.9,75.12 | v13.9,72.5 13.9,70.75 U$3.LEDNEG
  Bottom 0.152: v13.02,76.88 13.02,76 v13.9,75.12 | v13.9,72.5 v13.9,74.25
N$24  (via drill 0.3)
  Top 0.152: R5.1 4.52,58.12 6.4,58.12 C2.2 6.52,58.25 9.9,58.25 IC2.7 10.02,58.12 12.15,58.12 v17.65,52.62 | v18.65,51.62 18.65,49.38 17.77,48.5 17.77,41.75 30.15,29.38 v30.15,29.12 U$8.TIP@2
  Bottom 0.152: v18.65,51.62 v17.65,52.62 | v30.15,29.12 U$8.TIP@2
N$43  (via drill 0.3)
  Top 0.152: R67.1 17.15,38 v17.52,37.62 19.15,36 GATE.TIP@2
  Bottom 0.152: v17.52,37.62 19.15,36 GATE.TIP@2
N$64
  Top 0.152: D2.C 7.77,102.25 4.77,102.25 U$1.1 4.65,102.38 2.27,102.38 U$1.2
N$66  (via drill 0.3)
  Top 0.152: v11.65,38 R67.2 | v8.4,41.5 6.4,41.5 2.4,45.5 2.4,46.88 3.4,47.88 Q2.B
  Bottom 0.152: v11.65,38 11.65,38.25 v8.4,41.5
PTA1  (via drill 0.3)
  Top 0.152: v20.77,94.88 20.77,90.12 U1.23
  Bottom 0.152: v20.77,94.88 20.77,97.25 21.27,97.75 SWD1.10
RACK_GATE  (via drill 0.3)
  Top 0.152: v25.15,31 24.65,31 | 24.65,31 GATE.SWITCH@2 | 3.65,84.62 4.65,84.62 U$1.15 | 3.65,84.62 2.27,84.62 U$1.16 | v24.65,34 24.65,31 | v25.52,50.62 v25.52,34.88 | v22.52,53.62 22.52,60.25 20.52,62.25 19.77,62.25 v19.27,61.75 | v13.15,67.88 12.9,67.88 v10.4,70.38 | v7.65,76 v7.65,73.12 | v6.4,81.88 v6.4,77.25 | 3.65,84.62 v5.15,83.12
  Bottom 0.152: GATE.SWITCH@2 v25.15,31 | v25.52,34.88 v24.65,34 | v22.52,53.62 v25.52,50.62 | v13.15,67.88 v19.27,61.75 | v7.65,73.12 v10.4,70.38 | v6.4,77.25 v7.65,76 | v5.15,83.12 v6.4,81.88
SW1  (via drill 0.3)
  Top 0.152: v18.27,88.75 18.4,88.62 19.27,88.62 U1.2 | v18.27,86.5 18.02,86.5 14.9,83.38 14.15,83.38 12.27,81.5 12.27,76.88 3.65,68.25 v3.65,65 | v3.65,63 3.65,62.62 0.9,59.88 0.9,42.5 U$6.1 3.27,40.25 8.15,40.25 U$6.2
  Bottom 0.152: v18.27,86.5 v18.27,88.75 | v3.65,63 v3.65,65
SW2  (via drill 0.3)
  Top 0.152: 19.27,71.25 R23.1 | 19.27,71.25 17.77,69.75 U$3.2 | v24.9,89.12 24.4,88.62 23.77,88.62 U1.17 | v20.27,78.62 19.9,78.62 17.77,76.5 17.77,74.75 U$3.1 | v18.15,72.38 19.27,71.25
  Bottom 0.152: v24.9,89.12 24.9,88.88 20.27,84.25 v20.27,78.62 | v18.15,72.38 18.15,74.25 17.77,74.62 U$3.1
SW2LED  (via drill 0.3)
  Top 0.152: v17.52,81.62 14.65,78.75 14.15,78.75 R22.2 | v18.65,84.5 v17.52,83.38 | v23.9,89.75 23.9,89.25 23.77,89.12 U1.18
  Bottom 0.152: v17.52,83.38 v17.52,81.62 | v23.9,89.75 v18.65,84.5
VEE  (via drill 0.3)
  Top 0.152: R10.1 14.65,50.75 | 14.65,50.75 R11.1 | v0.9,82.25 0.9,97.62 1.77,98.5 5.9,98.5 9.52,102.12 11.52,102.12 D2.A | v1.77,77.38 v1.77,81.38 | v1.77,76.12 1.77,64.75 1.9,64.62 v1.9,63 | v1.52,57 v1.52,59.62 | v2.77,55.75 6.9,51.62 v8.27,51.62 | 14.65,50.75 v9.15,50.75
  Bottom 0.152: v1.77,81.38 v0.9,82.25 | v1.77,76.12 v1.77,77.38 | v1.9,63 1.52,62.62 1.4,62.62 0.4,61.62 0.4,60.75 v1.52,59.62 | v2.77,55.75 v1.52,57 | v9.15,50.75 v8.27,51.62
VIN  (via drill 0.3)
  Top 0.152: IC1.3 15.27,98.38 13.15,98.38 C11.2 13.02,98.25 12.77,98 10.4,98 C13.+ 10.27,97.88 10.15,97.75 8.4,97.75 | 8.4,97.75 7.27,97.75 D1.C | v8.4,94.75 8.4,93.38 7.65,92.62 7.65,84.62 IC3.3 | 8.4,97.75 v8.4,96
  Bottom 0.152: v8.4,96 v8.4,94.75